# EAGLE design Board_V07A (EAGLE 9.3.0)
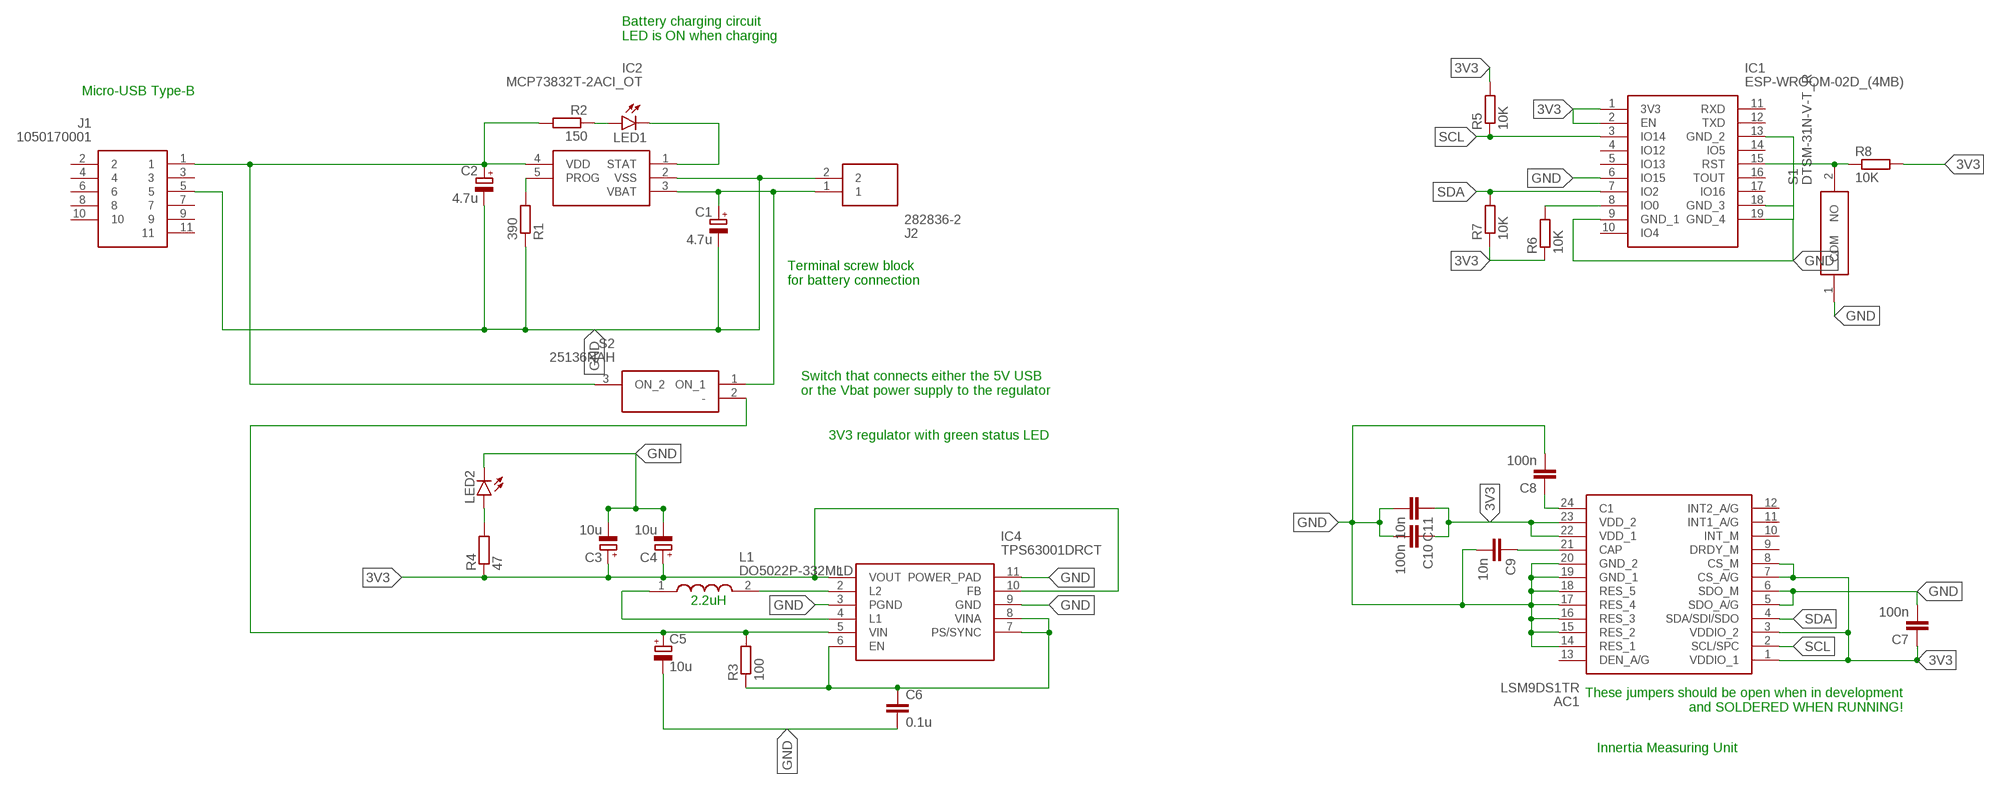
[diagram p0: schematic, sheet 1]

## Parts
AC1  LSM9DS1TR  [LGA-24L(3X3.5X1MM)]
C1  4.7u  CPOL-EUD/7343-31R  [D/7343-31R]
C2  4.7u  CPOL-EUD/7343-31R  [D/7343-31R]
C3  10u  CPOL-EUD/7343-31R  [D/7343-31R]
C4  10u  CPOL-EUD/7343-31R  [D/7343-31R]
C5  10u  CPOL-EUD/7343-31R  [D/7343-31R]
C6  0.1u  C-EUC0402  [C0402]
C7  100n  C-EUC0805  [C0805]
C8  100n  C-EUC0805  [C0805]
C9  10n  C-EUC0805  [C0805]
C10  100n  C-EUC0805  [C0805]
C11  10n  C-EUC0805  [C0805]
IC1  ESP-WROOM-02D_(4MB)  [ESPWROOM02D]
IC2  MCP73832T-2ACI_OT  [SOT95P270X145-5N]
IC4  TPS63001DRCT  [SON50P300X300X100-11N]
J1  1050170001  [MICROUSB-BTYPE]
J2  282836-2  [SHDR2W100P0X500_1X2_1000X820X1]
L1  DO5022P-332MLD  [DO5022P-104MLD]
LED1  LED5MM  [LED5MM]
LED2  LED5MM  [LED5MM]
R1  390  R-EU_R0805  [R0805]
R2  150  R-EU_R0805  [R0805]
R3  100  R-EU_R0805  [R0805]
R4  47  R-EU_R0805  [R0805]
R5  10K  R-EU_R0805  [R0805]
R6  10K  R-EU_R0805  [R0805]
R7  10K  R-EU_R0805  [R0805]
R8  10K  R-EU_R0805  [R0805]
S1  DTSM-31N-V-T_R  [DTSM32NVTR]
S2  25136NAH  [25136NAH]

## Nets
3V3 [thin]: AC1.1(VDDIO_1) AC1.3(VDDIO_2) AC1.7(CS_A/G) AC1.8(CS_M) AC1.22(VDD_1) AC1.23(VDD_2) C3.+ C4.+ C7.1 C10.1 C11.1 IC1.1(3V3) IC1.2(EN) IC4.1(VOUT) IC4.10(FB) R4.1 R5.2 R6.1 R7.1 R8.2
5V: C2.+ IC2.4(VDD) J1.1 R2.2 S2.3(ON_2)
GND [thin]: AC1.5(SDO_A/G) AC1.6(SDO_M) AC1.14(RES_1) AC1.15(RES_2) AC1.16(RES_3) AC1.17(RES_4) AC1.18(RES_5) AC1.19(GND_1) AC1.20(GND_2) C1.- C2.- C3.- C4.- C5.- C6.2 C7.2 C8.2 C9.2 C10.2 C11.2 IC1.6(IO15) IC1.9(GND_1) IC1.13(GND_2) IC1.18(GND_3) IC1.19(GND_4) IC2.2(VSS) IC4.3(PGND) IC4.9(GND) IC4.11(POWER_PAD) J1.5 J2.2 LED2.K(C) R1.1 S1.1(COM)
N$1: IC2.5(PROG) R1.2
N$2: LED1.A R2.1
N$3 [thin]: AC1.21(CAP) C9.1
N$4 [thin]: C5.+ IC4.5(VIN) R3.2 S2.2(-)
N$5: LED2.A R4.2
N$6: IC1.15(RST) R8.1 S1.2(NO)
N$7 [thin]: IC4.2(L2) L1.2
N$8 [thin]: IC4.4(L1) L1.1
N$10: C6.1 IC4.6(EN) IC4.7(PS/SYNC) IC4.8(VINA) R3.1
N$11 [thin]: AC1.24(C1) C8.1
N$21: IC1.8(IO0) R6.2
SCL [thin]: AC1.2(SCL/SPC) IC1.3(IO14) R5.1
SDA [thin]: AC1.4(SDA/SDI/SDO) IC1.7(IO2) R7.2
STAT: IC2.1(STAT) LED1.K(C)
VBAT: C1.+ IC2.3(VBAT) J2.1 S2.1(ON_1)
Unconnected: AC1.9(DRDY_M) AC1.10(INT_M) AC1.11(INT1_A/G) AC1.12(INT2_A/G) AC1.13(DEN_A/G) IC1.4(IO12) IC1.5(IO13) IC1.10(IO4) IC1.11(RXD) IC1.12(TXD) IC1.14(IO5) IC1.16(TOUT) IC1.17(IO16) J1.2 J1.3 J1.4 J1.6 J1.7 J1.8 J1.9 J1.10 J1.11

## Notes on the sheet
- Battery charging circuit
  LED is ON when charging
- Micro-USB Type-B
- Terminal screw block 
  for battery connection
- Switch that connects either the 5V USB
  or the Vbat power supply to the regulator
- 3V3 regulator with green status LED
- 2.2uH
- These jumpers should be open when in development
  and SOLDERED WHEN RUNNING!
- Innertia Measuring Unit

## Library data of the parts
AC1 = SamacSys_Parts:LSM9DS1TR: iNEMO Inertial 3D Accel/Gyro/Magn. LGA24 STMicroelectronics LSM9DS1TR 3-Axis Accelerometer, Gyroscope & Magnetometer, 0 400 kHz, 1.9 3.6 V Source: Datasheet <http://www.st.com/content/ccc/resource/technical/document/datasheet/1e/3f/2a/d6/25/eb/48/46/DM00103319.pdf/files/DM00103319.pdf/jcr:content/translations/en.DM00103319.pdf>; DESCRIPTION: iNEMO Inertial 3D Accel/Gyro/Magn. LGA24 STMicroelectronics LSM9DS1TR 3-Axis Accelerometer, Gyroscope & Magnetometer, 0 400 kHz, 1.9 3.6 V; HEIGHT: mm; MANUFACTURER_NAME: STMicroelectronics; MANUFACTURER_PART_NUMBER: LSM9DS1TR; MOUSER_PART_NUMBER: 511-LSM9DS1TR; MOUSER_PRICE-STOCK: https://www.mouser.com/Search/Refine.aspx?Keyword=511-LSM9DS1TR; RS_PART_NUMBER: 1660908; RS_PRICE-STOCK: http://uk.rs-online.com/web/p/products/1660908
C1-C5 = rcl:CPOL-EU: POLARIZED CAPACITOR, European symbol; SPICEPREFIX: C
C6-C11 = rcl:C-EU: CAPACITOR, European symbol; SPICEPREFIX: C
IC1 = SamacSys_Parts:ESP-WROOM-02D_(4MB): WiFi Modules (802.11) SMD Module, ESP8266EX, 32Mbits SPI flash, UART Mode, PCB antenna Source: Datasheet <https://www.mouser.in/datasheet/2/891/esp-wroom-02d_esp-wroom-02u_datasheet_en-1365835.pdf>; DESCRIPTION: WiFi Modules (802.11) SMD Module, ESP8266EX, 32Mbits SPI flash, UART Mode, PCB antenna; HEIGHT: 3.2mm; MANUFACTURER_NAME: Espressif; MANUFACTURER_PART_NUMBER: ESP-WROOM-02D (4MB); MOUSER_PART_NUMBER: 356-ESPWROOM02D(4MB)
IC2 = SamacSys_Parts:MCP73832T-2ACI_OT: Battery Charger Lithium-Ion, Lithium-Polymer Source: Datasheet <http://docs-emea.rs-online.com/webdocs/1381/0900766b81381752.pdf>; ALLIED_NUMBER: 70046199; ALLIED_PRICE-STOCK: http://www.alliedelec.com/microchip-technology-inc-mcp73832t-2aci-ot/70046199/; DESCRIPTION: Battery Charger Lithium-Ion, Lithium-Polymer; HEIGHT: 1.45mm; MANUFACTURER_NAME: Microchip; MANUFACTURER_PART_NUMBER: MCP73832T-2ACI/OT; MOUSER_PART_NUMBER: 579-MCP73832T-2ACIOT; MOUSER_PRICE-STOCK: https://www.mouser.com/Search/Refine.aspx?Keyword=579-MCP73832T-2ACIOT; RS_PART_NUMBER: 9122897; RS_PRICE-STOCK: http://uk.rs-online.com/web/p/products/9122897
IC4 = SamacSys_Parts:TPS63001DRCT: 96% Buck-Boost Converter with 1.7A Current Switches, 3.3V fixed Output voltage in 3x3 QFN Source: Datasheet <http://uk.rs-online.com/web/p/products/7968405>; DESCRIPTION: 96% Buck-Boost Converter with 1.7A Current Switches, 3.3V fixed Output voltage in 3x3 QFN; HEIGHT: mm; MANUFACTURER_NAME: Texas Instruments; MANUFACTURER_PART_NUMBER: TPS63001DRCT; RS_PART_NUMBER: 7968405
J1 = SamacSys_Parts:1050170001: USB Connectors MICRO USB B REC RA SMT BOT Source: Datasheet <http://www.mouser.com/ds/2/276/1050170001_IO_CONNECTORS-230168.pdf>; DESCRIPTION: USB Connectors MICRO USB B REC RA SMT BOT; HEIGHT: mm; MANUFACTURER_NAME: Molex; MANUFACTURER_PART_NUMBER: 1050170001; MOUSER_PART_NUMBER: N/A; MOUSER_PRICE-STOCK: https://www.mouser.com/Search/Refine.aspx?Keyword=N%2FA
J2 = SamacSys_Parts:282836-2: TERMINAL BLOCK, PCB MOUNT, SIDE WIRE ENTRY, STACKING , 5.00mm PITCH Source: Datasheet <http://www.te.com/commerce/DocumentDelivery/DDEController?Action=srchrtrv&DocNm=282836&DocType=Customer Drawing&DocLang=English>; ALLIED_NUMBER: 70086275; ALLIED_PRICE-STOCK: https://www.alliedelec.com/te-connectivity-282836-2/70086275/; DESCRIPTION: TERMINAL BLOCK, PCB MOUNT, SIDE WIRE ENTRY, STACKING , 5.00mm PITCH; HEIGHT: 10.2mm; MANUFACTURER_NAME: TE Connectivity; MANUFACTURER_PART_NUMBER: 282836-2; MOUSER_PART_NUMBER: 571-2828362; MOUSER_PRICE-STOCK: https://www.mouser.com/Search/Refine.aspx?Keyword=571-2828362; RS_PART_NUMBER: 1354983; RS_PRICE-STOCK: http://uk.rs-online.com/web/p/products/1354983
L1 = SamacSys_Parts:DO5022P-332MLD: Fixed Inductors DO5022P Pwr Inductor 3.3 uH 20 % 6.2 A Source: Datasheet <https://www.coilcraft.com/pdfs/do5022p.pdf>; DESCRIPTION: Fixed Inductors DO5022P Pwr Inductor 3.3 uH 20 % 6.2 A; HEIGHT: mm; MANUFACTURER_NAME: COILCRAFT; MANUFACTURER_PART_NUMBER: DO5022P-332MLD; MOUSER_PART_NUMBER: 994-DO5022P-332MLD; MOUSER_PRICE-STOCK: https://www.mouser.com/Search/Refine.aspx?Keyword=994-DO5022P-332MLD
LED1 LED2 = led:LED: LED OSRAM: - CHIPLED LG R971, LG N971, LY N971, LG Q971, LY Q971, LO R971, LY R971 LH N974, LH R974 LS Q976, LO Q976, LY Q976 LO Q996 - Hyper CHIPLED LW Q18S LB Q993, LB Q99A, LB R99A - SideLED LS A670, LO A670, LY A670, LG A670, LP A670 LB A673, LV A673, LT A673, LW A673 LH A674 LY A675 LS A676, LA A676, LO A676, LY A676, LW A676 LS A679, LY A679, LG A679 - Hyper Micro SIDELED® LS Y876, LA Y876, LO Y876, LY Y876 LT Y87S - SmartLED LW L88C, LW L88S LB L89C, LB L89S, LG L890 LS L89K, LO L89K, LY L89K LS L896, LA L896, LO L896, LY L896 - TOPLED LS T670, LO T670, LY T670, LG T670, LP T670 LSG T670, LSP T670, LSY T670, LOP T670, LYG T670 LG T671, LOG T671, LSG T671 LB T673, LV T673, LT T673, LW T673 LH T674 LS T676, LA T676, LO T676, LY T676, LB T676, LH T676, LSB T676, LW T676 LB T67C, LV T67C, LT T67C, LS T67K, LO T67K, LY T67K, LW E67C LS E67B, LA E67B, LO E67B, LY E67B, LB E67C, LV E67C, LT E67C LW T67C LS T679, LY T679, LG T679 LS T770, LO T770, LY T770, LG T770, LP T770 LB T773, LV T773, LT T773, LW T773 LH T774 LS E675, LA E675, LY E675, LS T675 LS T776, LA T776, LO T776, LY T776, LB T776 LHGB T686 LT T68C, LB T68C - Hyper Mini TOPLED® LB M676 - Mini TOPLED Santana® LG M470 LS M47K, LO M47K, LY M47K Source: http://www.osram.convergy.de LUXEON: - LUMILED® LXK2-PW12-R00, LXK2-PW12-S00, LXK2-PW14-U00, LXK2-PW14-V00 LXK2-PM12-R00, LXK2-PM12-S00, LXK2-PM14-U00 LXK2-PE12-Q00, LXK2-PE12-R00, LXK2-PE12-S00, LXK2-PE14-T00, LXK2-PE14-U00 LXK2-PB12-K00, LXK2-PB12-L00, LXK2-PB12-M00, LXK2-PB14-N00, LXK2-PB14-P00, LXK2-PB14-Q00 LXK2-PR12-L00, LXK2-PR12-M00, LXK2-PR14-Q00, LXK2-PR14-R00 LXK2-PD12-Q00, LXK2-PD12-R00, LXK2-PD12-S00 LXK2-PH12-R00, LXK2-PH12-S00 LXK2-PL12-P00, LXK2-PL12-Q00, LXK2-PL12-R00 Source: www.luxeon.com KINGBRIGHT: KA-3528ASYC Source: www.kingbright.com
R1-R8 = rcl:R-EU_: RESISTOR, European symbol; SPICEPREFIX: R
S1 = SamacSys_Parts:DTSM-31N-V-T_R: Tactile Switches SMT Type 3.5*6 Source: Datasheet <http://www.dip.com.tw/en/en-product-information/en-switch004/item/2444-dts-3-dtsm-l-3>; DESCRIPTION: Tactile Switches SMT Type 3.5*6; HEIGHT: 5mm; MANUFACTURER_NAME: Diptronics; MANUFACTURER_PART_NUMBER: DTSM-31N-V-T/R; MOUSER_PART_NUMBER: 113-DTSM31NVTR; MOUSER_PRICE-STOCK: https://www.mouser.com/Search/Refine.aspx?Keyword=113-DTSM31NVTR
S2 = SamacSys_Parts:25136NAH: PCB Slide Switch SPDT On-On 4 A@ 125 V ac Slide Source: Datasheet <https://www.apem.com/int/index.php?controller=attachment&id_attachment=858>; DESCRIPTION: PCB Slide Switch SPDT On-On 4 A@ 125 V ac Slide; HEIGHT: 8mm; MANUFACTURER_NAME: Apem; MANUFACTURER_PART_NUMBER: 25136NAH; MOUSER_PART_NUMBER: 642-25136NAH; MOUSER_PRICE-STOCK: https://www.mouser.com/Search/Refine.aspx?Keyword=642-25136NAH; RS_PART_NUMBER: 0339673A; RS_PRICE-STOCK: http://uk.rs-online.com/web/p/products/0339673A

## Net classes
0 default: width 0.305 mm, clearance 0.205 mm
1 ground: width 0.61 mm, clearance 0.205 mm to class 0, clearance 0.205 mm
2 power: width 0.508 mm, clearance 0.205 mm to class 0, clearance 0.205 mm to class 1, clearance 0.205 mm
3 thin: width 0.152 mm, clearance 0.205 mm to class 0, clearance 0.205 mm to class 1, clearance 0.205 mm to class 2, clearance 0.205 mm

## Board
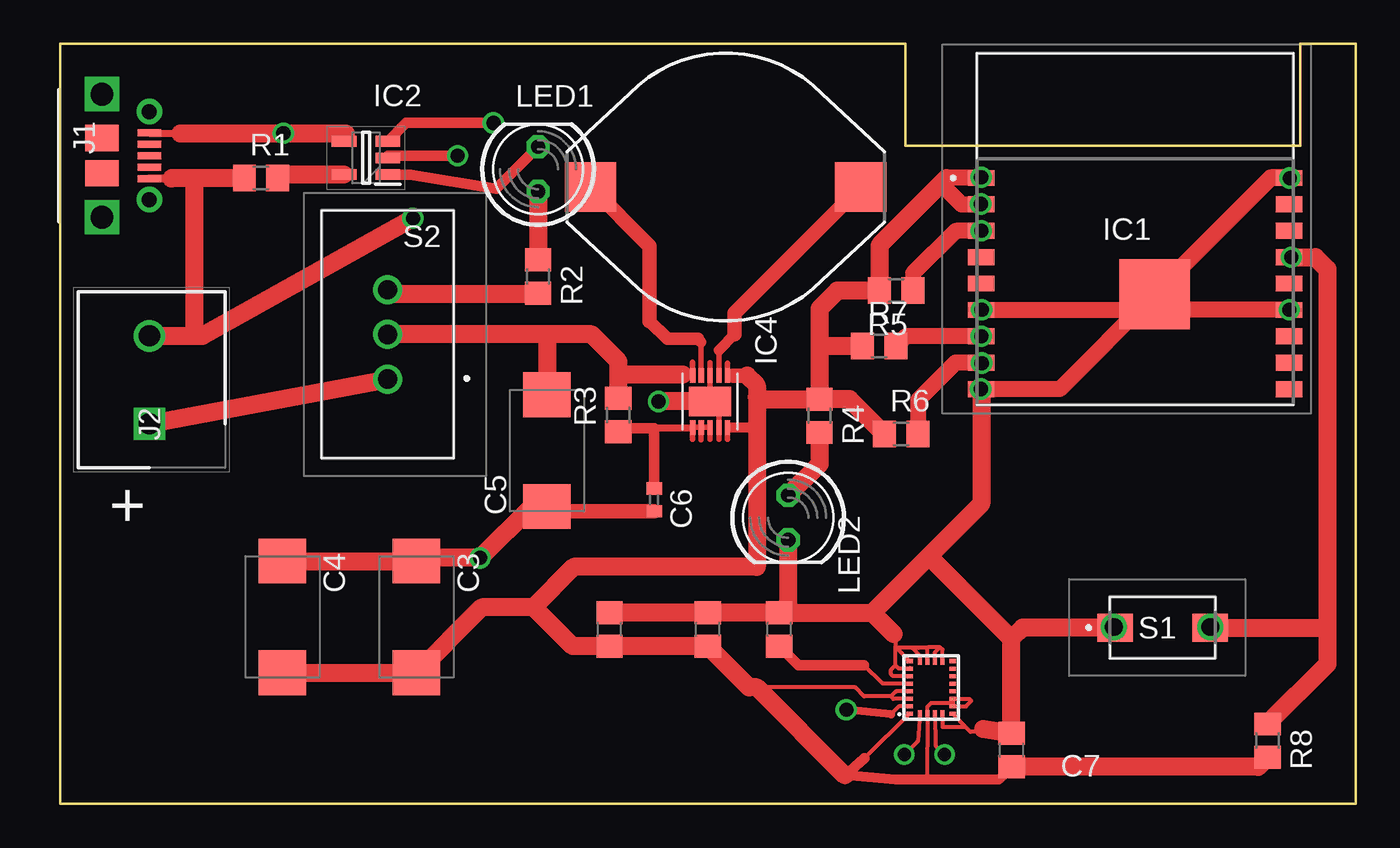
[diagram p1: board, top side]
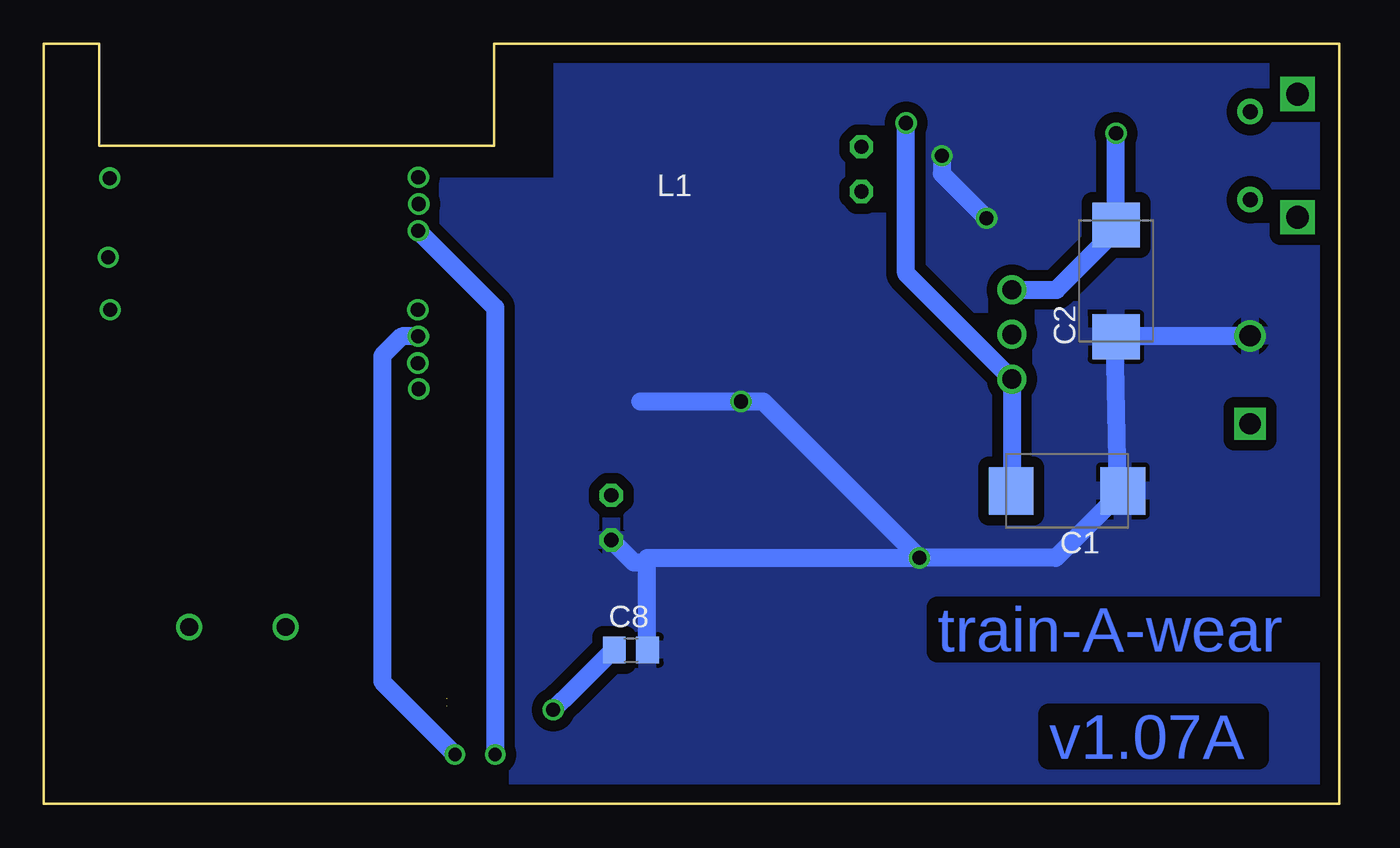
[diagram p2: board, bottom side, seen from below]

Size 73.66 x 43.18 mm. Coordinates in mm from the lower left corner, seen from the top.
Outline: 0,0 0,43.18 48.06,43.18 48.06,37.39 70.51,37.39 70.51,43.18 73.66,43.18 73.66,0 0,0
Copper layers (1*16): Top 0.035mm / dielectric 1.5mm / Bottom 0.035mm
Design rules "default": minimum track width 6mil, minimum drill 0.35mm, track to track 6mil, track to pad 6mil, pad to pad 6mil, via to via 6mil, smd to smd 6mil, copper to edge 40mil, drill to drill 6mil, minimum pad ring 10mil, minimum via ring 8mil, stop-mask expansion 4mil, vias tented up to drill 0mil, thermal gap 10mil

### Footprints (pad centres in the part's own frame; a part is rotated, then mirrored left to right if it is on the bottom)
LGA-24L(3X3.5X1MM) = smd 0.23 x 0.35: 1 -1.505,1.225; 6 -1.505,-1.225; 7 -1.075,-1.225; 8 -0.645,-1.225; 9 -0.215,-1.225; 10 0.215,-1.225; 11 0.645,-1.225; 12 1.075,-1.225; 13 1.505,-1.225; 18 1.505,1.225; 19 1.075,1.225; 20 0.645,1.225; 21 0.215,1.225; 22 -0.215,1.225; 23 -0.645,1.225; 24 -1.075,1.225 | smd 0.35 x 0.23: 2 -1.475,0.645; 3 -1.475,0.215; 4 -1.475,-0.215; 5 -1.475,-0.645; 14 1.475,-0.645; 15 1.475,-0.215; 16 1.475,0.215; 17 1.475,0.645
D/7343-31R = smd 2.55 x 2.7: + 3.175,0; - -3.175,0
C0402 = smd 0.7 x 0.9: 1 -0.65,0; 2 0.65,0
C0805 = smd 1.3 x 1.5: 1 -0.95,0; 2 0.95,0
ESPWROOM02D = smd 1.5 x 0.9: 1 -8.025,2.9; 2 -8.025,1.4; 3 -8.025,-0.1; 4 -8.025,-1.6; 5 -8.025,-3.1; 6 -8.025,-4.6; 7 -8.025,-6.1; 8 -8.025,-7.6; 9 -8.025,-9.1; 10 9.475,-9.1; 11 9.475,-7.6; 12 9.475,-6.1; 13 9.475,-4.6; 14 9.475,-3.1; 15 9.475,-1.6; 16 9.475,-0.1; 17 9.475,1.4; 18 9.475,2.9 | smd 4 x 4: 19 1.825,-3.71
SOT95P270X145-5N = smd 1.4 x 0.6: 1 -1.25,0.95; 2 -1.25,0; 3 -1.25,-0.95; 4 1.25,-0.95; 5 1.25,0.95
SON50P300X300X100-11N = smd 0.813 x 0.305: 1 -1.473,0.991; 2 -1.473,0.508; 3 -1.473,0; 4 -1.473,-0.508; 5 -1.473,-0.991; 6 1.473,-0.991; 7 1.473,-0.508; 8 1.473,0; 9 1.473,0.508; 10 1.473,0.991 | smd 1.651 x 2.388: 11 0,0
MICROUSB-BTYPE = smd 0.4 x 1.35: 1 -1.3,0; 2 -0.65,0; 3 0,0; 4 0.65,0; 5 1.3,0 | drill 0.85 pad 1.45: 6 -2.5,0; 7 2.5,0 | drill 1.3 pad 1.9 square: 8 -3.5,-2.7; 9 3.5,-2.7 | smd 1.5 x 1.9: 10 -1,-2.7; 11 1,-2.7
SHDR2W100P0X500_1X2_1000X820X1 = drill 1.2 pad 1.8 square: 1 0,0 | drill 1.2 pad 1.8: 2 5,0
DO5022P-104MLD = smd 2.92 x 2.79: 1 -7.685,0; 2 7.685,0
LED5MM = drill 0.813 octagon: A -1.27,0; K 1.27,0
R0805 = smd 1.3 x 1.5: 1 -0.95,0; 2 0.95,0
DTSM32NVTR = smd 2 x 1.6: 1 -2.7,0; 2 2.7,0
25136NAH = drill 1.1 pad 1.65: 1 -0.425,-2.54; 2 -0.425,0; 3 -0.425,2.54

### Placement (x,y rotation side)
AC1  49.53,6.6 90 top
C1  15.49,17.78 180 bottom
C2  12.7,29.72 90 bottom
C3  20.27,10.62 270 top
C4  12.65,10.62 270 top
C5  27.69,20.07 90 top
C6  33.78,17.27 270 top
C7  54.1,3.05 90 top
C8  40.28,8.74 0 bottom
C9  40.89,9.91 90 top
C10  36.83,9.91 90 top
C11  31.24,9.91 90 top
IC1  60.4,32.66 0 top
IC2  17.4,36.7 180 top
IC4  36.96,22.86 270 top
J1  5.08,36.83 270 top
J2  5.08,21.59 90 top
L1  37.85,35.05 0 top
LED1  27.18,36.07 90 top
LED2  41.4,16.26 270 top
R1  11.43,35.56 0 top
R2  27.18,29.97 270 top
R3  31.75,22.1 90 top
R4  43.18,22.05 270 top
R5  47.55,29.16 180 top
R6  47.83,21.01 0 top
R7  46.58,26.01 0 top
R8  68.66,3.58 270 top
S1  62.69,10.01 0 top
S2  19.05,26.67 0 top

### Tracks (layer width: path | path; a pad name or v marks a point on that pad's centre or on a via)
3V3  (2 unrouted)
  Top 0.229: IC4.10 38.1,21.39 | IC4.1 38.25,24.33 | 39.62,6.6 45.21,6.6 45.72,6.1 47.24,6.1 | AC1.23 47.38,5.96 47.24,6.1 | AC1.22 47.54,6.39 47.24,6.1 | AC1.8 50.75,5.92 | AC1.1 45.74,2.58 | 49.28,1.27 AC1.3 49.31,5.5 49.53,5.71 50.57,5.71 50.76,5.9 AC1.8 | AC1.8 50.76,5.92 | 49.28,1.37 49.28,1.27 | 49.28,1.27 | AC1.8 51.7,5.96 51.82,5.84 51.51,5.53 AC1.7 AC1.8
  Top 0.305: 38.25,24.33 39.22,24.33 39.19,24.31 | IC4.10 37.95,20.7 | IC4.1 37.95,25.04
  Top 0.559: 39.62,23.11 39.74,23 | 39.62,21.34 39.57,21.39 38.1,21.39 | C7.1 53.38,1.37 49.28,1.37 47.51,1.37 44.65,1.63
  Top 0.61: 45.74,2.58 44.65,1.63
  Top 0.813: 39.06,24.33 38.25,24.33
  Top 0.914: IC1.1 50.42,35.56 50.09,35.23 51.25,34.06 IC1.2
  Top 1.016: 39.74,23 R4.1 | 20.9,8.08 C3.+ | 39.06,24.33 39.62,23.77 39.62,23.11 39.62,21.34 39.62,13.46 29.21,13.46 26.92,11.18 | C4.+ C3.+ | 26.92,11.18 26.87,11.18 26.87,11.15 23.98,11.15 C3.+ | 26.92,11.18 29.14,8.96 C11.1 C10.1 39.18,6.6 39.62,6.6 44.6,1.63 44.65,1.63 | 50.42,35.56 46.6,31.74 R5.2 44.2,29.16 43.18,28.14 43.18,25.98 | 43.18,25.98 R4.1 | R7.1 43.2,26.01 43.18,25.98 | R6.1 44.89,23 R4.1 | R8.2 68.12,2.1 C7.1
5V  (via drill 0.8)
  Top 0.406: J1.1 5.11,38.1 6.86,38.1
  Top 0.61: 16.26,38.1 16.15,37.99 IC2.4
  Top 0.813: 27.24,28.96 R2.2
  Top 1.016: 27.24,28.96 18.88,28.96 S2.3 | 6.86,38.1 v12.7,38.1 16.26,38.1
  Bottom 1.016: S2.3 16.09,29.21 12.7,32.59 C2.+ v12.7,38.1
GND  (via drill 0.8)
  Top 0.229: 47.56,8.85 AC1.18 48.34,8.08 | 47.5,9.65 47.5,8.92 | 52.49,4.25 52.77,4.08 51.77,4.08 51.47,4.38 | AC1.6 51.47,4.38 | 48.34,7.71 AC1.19 47.69,7.68 47.5,7.87 | AC1.14 50.17,8.75 50.04,8.89 | AC1.15 49.74,8.6 50.04,8.89 | AC1.16 49.31,8.85 | 49.31,8.85 49.28,8.89 | AC1.17 48.88,8.42 48.45,8.85 | AC1.20 47.36,7.25 47.24,7.37 47.24,7.62 47.5,7.87 | 50.04,8.89 49.35,8.89 49.31,8.85 | 49.31,8.85 48.81,8.85 | 48.81,8.85 48.77,8.89 | 47.5,7.87 47.5,8.92 | 48.81,8.85 48.45,8.85 | 48.45,8.85 47.56,8.85 | 47.56,8.85 47.5,8.92 | AC1.5 50.17,4.38 50.19,4.37 50.2,4.38 51.47,4.38
  Top 0.305: 36.96,25.07 IC4.3 36.96,23.5 36.83,23.37 36.96,23.24 IC4.11 37.47,22.35 IC4.9 37.47,20.7
  Top 0.457: 6.35,35.53 J1.5
  Top 0.61: v22.61,36.83 18.65,36.83 IC2.2
  Top 0.813: C6.2 27.95,16.62 C5.- | 47.4,9.65 47.5,9.65
  Top 0.914: IC1.13 63.12,28.06 IC1.19 | IC1.19 56.84,23.56 IC1.9 | IC1.6 61.34,28.06 IC1.19
  Top 0.965: IC1.18 68.84,35.56 IC1.19
  Top 1.016: v20.07,33.27 8.1,26.59 7.87,26.59 | J2.2 7.87,26.59 | IC4.11 v34.04,22.86 | 20.27,14.43 C3.- | C4.- C3.- | C11.2 C10.2 C9.2 | C9.2 46.19,10.86 | C3.- 20.45,13.97 v23.88,13.97 26.8,16.89 C5.- | 46.19,10.86 47.4,9.65 | 52.49,4.25 C7.2 54.1,9.37 | LED2.K 41.4,11.36 C9.2 | 10.42,35.5 R1.1 7.62,35.56 | 7.62,35.56 6.38,35.56 6.35,35.53 | 7.62,35.56 7.62,26.84 7.87,26.59 | IC1.9 52.38,17.04 49.41,14.07 | 49.41,14.07 46.19,10.86 | 54.1,9.37 49.41,14.07 | S1.1 54.74,10.01 54.1,9.37
  Bottom 1.016: J2.2 12.56,26.59 C2.- 12.81,26.42 12.64,18.1 C1.- 16.13,13.97 v23.88,13.97 | v23.88,13.97 32.77,22.86 v34.04,22.86 39.75,22.86 | LED2.K 40.13,13.72 39.37,13.72 | v23.88,13.97 39.37,13.97 39.37,13.72 | C8.2 39.37,8.74 39.37,13.72 | v22.61,36.83 22.61,35.81 v20.07,33.27
  pour Bottom (isolate 0.61): 0,0 0,43.18 44.2,43.18 44.2,35.05 73.66,35.05 73.66,0
N$1
  Top 1.016: IC2.5 12.57,35.75 R1.2
N$2
  Top 1.016: LED1.A R2.1
N$3
  Top 0.229: AC1.21 46.77,6.82 45.72,7.87
  Top 0.61: 45.72,7.87 41.98,7.87 C9.1
N$4
  Top 0.305: 35.41,24.38 35.46,24.33 IC4.5 35.97,25.09
  Top 1.016: 27.69,26.67 30.23,26.67 31.75,25.15 31.75,24.38 | 27.69,26.67 S2.2 | 35.41,24.38 31.75,24.38 | R3.2 31.75,24.38 | 27.69,26.67 C5.+
N$5
  Top 1.016: R4.2 43.18,19.3 LED2.A
N$6
  Top 1.016: IC1.15 71.37,31.06 72.06,30.38 72.06,10.03 | R8.1 72.06,7.93 72.06,10.03 | S1.2 72.03,10.01 72.06,10.03
N$7
  Top 0.305: IC4.2 37.47,25.78
  Top 0.61: 37.47,25.78 38.35,26.67
  Top 0.813: 38.35,26.67 38.35,27.88 L1.2
N$8
  Top 0.305: IC4.4 36.45,26.24
  Top 0.61: 36.45,26.24 36.27,26.42
  Top 0.711: 36.27,26.42 34.54,26.42 33.53,27.43
  Top 0.813: 33.53,27.43 33.53,31.68 L1.1
N$9  (via drill 0.8 pad 0.75)
  other vias: 52.37,35.61
N$10
  Top 0.305: IC4.7 IC4.8 36.96,20.7 | IC4.7 36.45,20.68 | IC4.7 IC4.6 | IC4.6 35.92,21.34 35.89,21.34 | IC4.6 35.97,20.7
  Top 0.406: 35.89,21.34 33.78,21.34
  Top 0.61: R3.1 31.94,21.34 33.78,21.34 C6.1
N$11  (via drill 0.8)
  Top 0.229: AC1.24 47.69,5.53 47.24,5.08
  Top 0.457: 47.24,5.08 v44.7,5.33
  Bottom 1.016: v44.7,5.33 44.11,5.93 44.09,5.93 41.28,8.74 C8.1
N$12  (via drill 0.8 pad 0.75)
  other vias: 52.35,34.09
N$13  (via drill 1 pad 0.8)
  other vias: 59.92,10.03
N$14  (via drill 0.8 pad 0.75)
  other vias: 52.4,28.07
N$15  (via drill 1 pad 0.8)
  other vias: 65.41,10.03
N$16  (via drill 0.8 pad 0.75)
  other vias: 52.4,25.04
N$17  (via drill 0.8 pad 0.75)
  other vias: 52.35,23.57
N$18  (via drill 0.8 pad 0.75)
  other vias: 69.9,28.07
N$19  (via drill 0.8 pad 0.75)
  other vias: 70,31.06
N$20  (via drill 0.8 pad 0.75)
  other vias: 69.93,35.56
N$21
  Top 0.914: IC1.8 50.92,25.06 48.78,22.92 R6.2
SCL  (via drill 0.75, 0.8 pad 0.75)
  Top 0.229: AC1.2 48.77,3.56 v48.01,2.79
  Top 0.914: IC1.3 50.93,32.56 48.5,30.14 R5.1
  Bottom 1.016: IC1.3 48.01,28.19 v48.01,2.79
  other vias: 52.38,32.56
SDA  (via drill 0.75, 0.8 pad 0.75)
  Top 0.229: AC1.4 49.78,3.3 v50.29,2.79
  Top 0.914: IC1.7 48.09,26.56 R7.2
  Bottom 1.016: IC1.7 53.32,26.56 54.43,25.45 54.43,6.93 v50.29,2.79
  other vias: 52.38,26.56
STAT
  Top 0.61: IC2.1 19.92,35.75 24.78,34.94 LED1.K
VBAT  (via drill 0.8)
  Top 0.61: IC2.3 19.69,38.69 v24.64,38.69
  Top 1.016: J2.1 S2.1
  Bottom 1.016: C1.+ 18.62,18.29 S2.1 24.64,30.14 v24.64,38.69

### Text on the board
Bottom: train-A-wear | v1.07A
tNames: +